# Altium schematic sheet E17-04-POWER.SchDoc
size A; DocumentNumber: 9; SheetNumber: 9; SheetTotal: 18
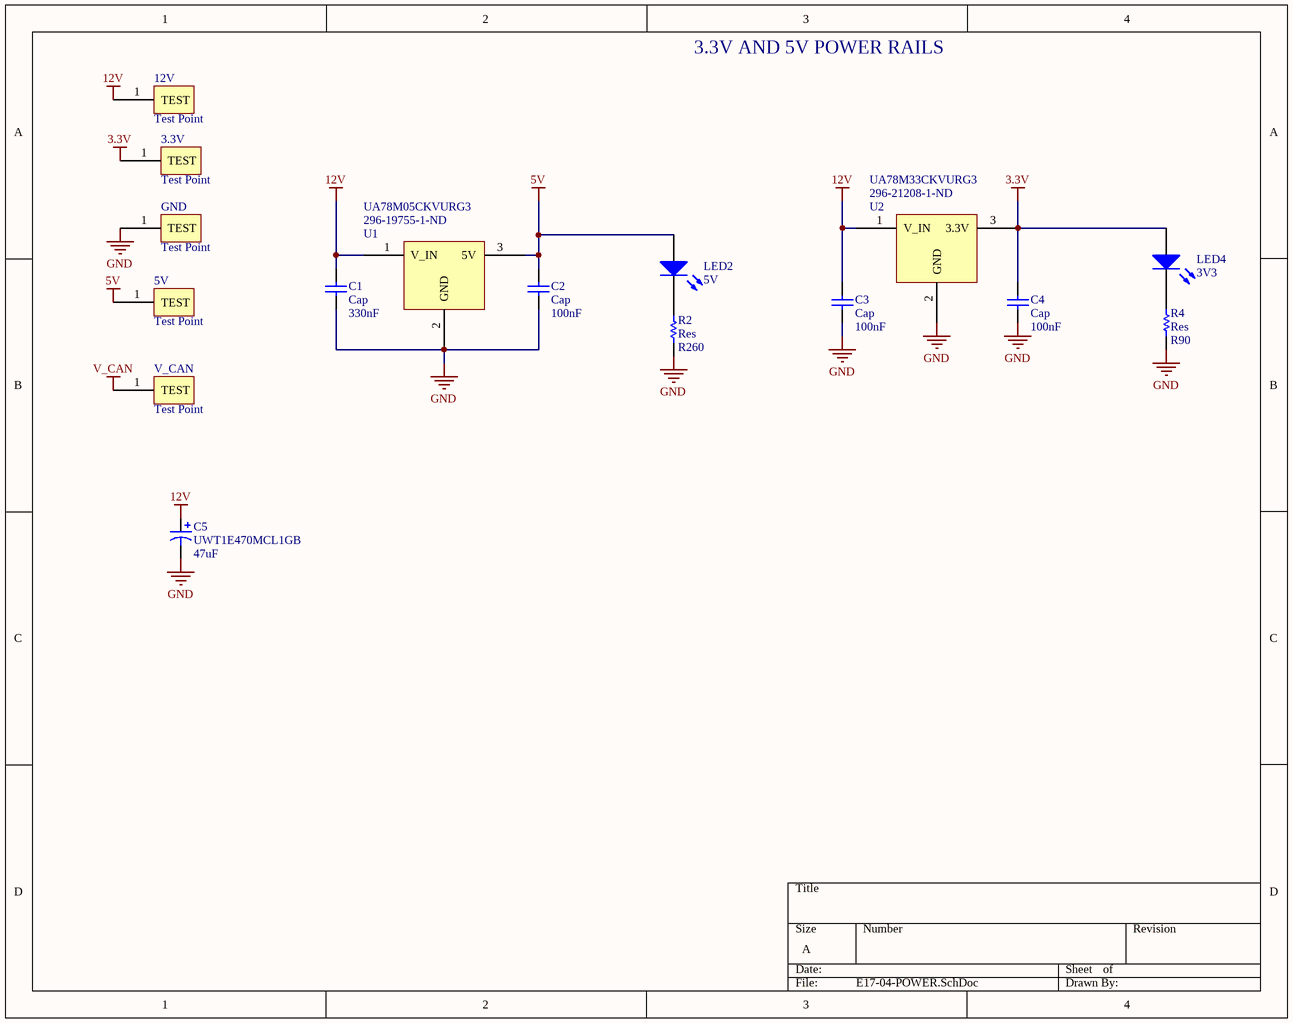
[diagram p0: E17-04-POWER.SchDoc]

## Parts
3.3V  Test Point  [TEST POINT 5000K]
5V  Test Point  [TEST POINT 5000K]
12V  Test Point  [TEST POINT 5000K]
C1  Cap  value 330nF  [C0805]
C2  Cap  value 100nF  [C0805]
C3  Cap  value 100nF  [C0805]
C4  Cap  value 100nF  [C0805]
C5  UWT1E470MCL1GB  value 47uF  [UWT1E470MCL1GB]
GND  Test Point  [TEST POINT 5000K]
LED2  5V  [155124VS73200]
LED4  3V3  [155124VS73200]
R2  Res  value R260  [2012[0805]]
R4  Res  value R90  [2012[0805]]
U1  UA78M05CKVURG3  Supplier Part Number 1: 296-19755-1-ND  [TO-252-3]
U2  UA78M33CKVURG3  Supplier Part Number 1: 296-21208-1-ND  [TO-252-3]
V_CAN  Test Point  [TEST POINT 5000K]

## Nets
3.3V: 3.3V.1(TEST) C4.2 LED4.2 U2.3(3.3V)
5V: 5V.1(TEST) C2.2 LED2.2 U1.3(5V)
12V: 12V.1(TEST) C1.2 C3.2 C5.1 U1.1(V_IN) U2.1(V_IN)
GND: C1.1 C2.1 C3.1 C4.1 C5.2 GND.1(TEST) R2.1 R4.1 U1.2(GND) U2.2(GND)
V_CAN: V_CAN.1(TEST)
NetLED2_1: LED2.1 R2.2
NetLED4_1: LED4.1 R4.2

## Notes on the sheet
- 3.3V AND 5V POWER RAILS

## Library data of the parts
3.3V 5V 12V GND V_CAN = Test Point: 5000-5004, 5015-5019 Keystone Electronics
C1-C4 = Cap: Capacitor; Published: 8-Jun-2000; LatestRevisionDate: 17-Jul-2002; LatestRevisionNote: Re-released for DXP Platform.; PackageReference: C1206; Publisher: Altium Limited
C5 = UWT1E470MCL1GB: CAP ALUM 47UF 25V 20% SMD; Published: 8-Jun-2000; LatestRevisionDate: 17-Jul-2002; LatestRevisionNote: Re-released for DXP Platform.; PackageReference: POLAR0.8; Publisher: Altium Limited; PackageDescription: Polarized Capacitor; 2 Leads
LED2 LED4 = 155124VS73200: Right Angle SMD Green 2V; Manufacturer: Wurth Electronics Inc; Lens Color: Colorless; Lens Transparency: Clear; Millicandela Rating: 50mcd; Lens Style/Size: Rectangle with Domed Top, 2.00mm x 1.00mm; Current - Test: 20mA; Viewing Angle: 120°; Wavelength - Dominant: 573nm; Wavelength - Peak: 575nm; Supplier 1: Digi-Key; Supplier Part Number 1: 732-5026-1-ND; RoHS: RoHS Compliant; Category: Optoelectronics; Stock 1: 4820; Pricing 1: 1=0.44, 50=0.3802, 100=0.3476, 500=0.31498, 1000=0.29326 (CAD); Packaging: Cut Tape (CT); Color: Green; Voltage - Forward (Vf) (Typ): 2V; Mounting Type: Surface Mount, Right Angle; Features: -; Package / Case: 2-SMD, Side View; Supplier Device Package: 1204; Size / Dimension: 3.20mm L x 1.50mm W; Height (Max): 1.20mm; ComponentLink1URL: http://katalog.we-online.de/led/datasheet/155124VS73200.pdf; ComponentLink1Description: http://katalog.we-online.de/led/datasheet/155124VS73200.pdf; Manufacturer Part Number: 155124VS73200
R2 R4 = Res: Surface Mount Resistor; Published: 8-Jun-2000; LatestRevisionDate: 17-Jul-2002; LatestRevisionNote: Re-released for DXP Platform.; PackageReference: AXIAL-0.5; Publisher: Altium Limited
U1 = UA78M05CKVURG3: 5.0V Regulator; Supplier 1: Digi-Key
U2 = UA78M33CKVURG3: 3.3V Regulator; Supplier 1: Digi-Key